# EAGLE schematic 32 pin BB (EAGLE 6.5.0)
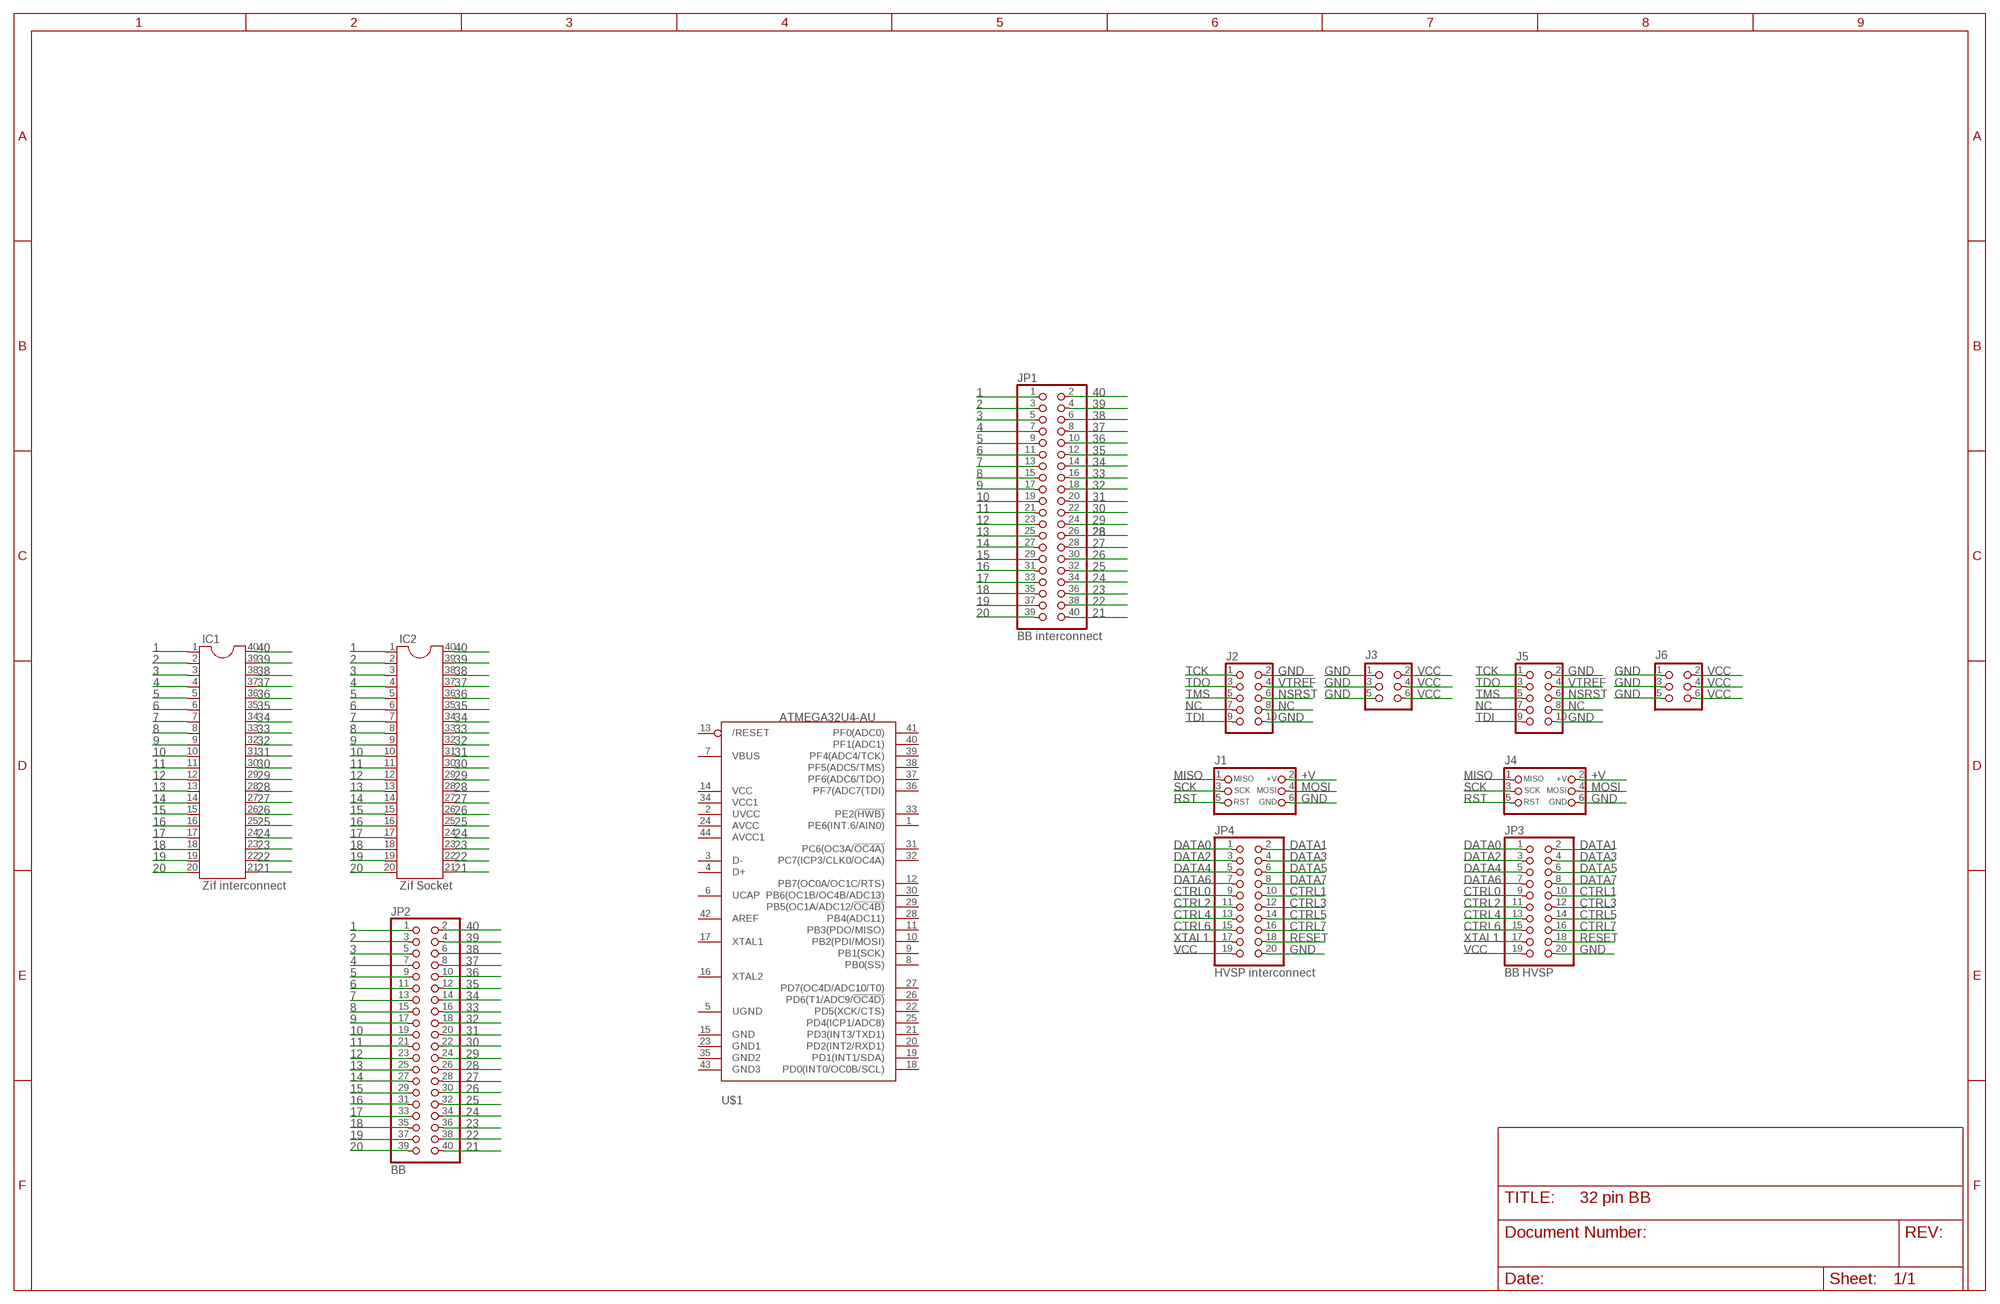
[diagram p0: schematic, sheet 1]

## Parts
IC1  Zif interconnect  DIL40  [DIL40]
IC2  Zif Socket  DIL40  [DIL40]
J1  CON_HEADER_PRG_AVR_ICSP  [HEADER_PRG_2X03]
J2  CON_HEADER_2X05-PTH  [M2X5]
J3  CON_HEADER_2X03-PTH  [M2X3]
J4  CON_HEADER_PRG_AVR_ICSP  [HEADER_PRG_2X03]
J5  CON_HEADER_2X05-PTH  [M2X5]
J6  CON_HEADER_2X03-PTH  [M2X3]
JP1  BB interconnect  PINHD-2X20  [2X20]
JP2  BB  PINHD-2X20  [2X20]
JP3  BB HVSP  PINHD-2X10  [2X10]
JP4  HVSP interconnect  PINHD-2X10  [2X10]
U$1  ATMEGA32U4-AU  [TQFP44]

## Nets
1: IC1.1 IC2.1 JP1.1 JP2.1
2: IC1.2 IC2.2 JP1.3 JP2.3
3: IC1.3 IC2.3 JP1.5 JP2.5
4: IC1.4 IC2.4 JP1.7 JP2.7
5: IC1.5 IC2.5 JP1.9 JP2.9
6: IC1.6 IC2.6 JP1.11 JP2.11
7: IC1.7 IC2.7 JP1.13 JP2.13
8: IC1.8 IC2.8 JP1.15 JP2.15
9: IC1.9 IC2.9 JP1.17 JP2.17
10: IC1.10 IC2.10 JP1.19 JP2.19
11: IC1.11 IC2.11 JP1.21 JP2.21
12: IC1.12 IC2.12 JP1.23 JP2.23
13: IC1.13 IC2.13 JP1.25 JP2.25
14: IC1.14 IC2.14 JP1.27 JP2.27
15: IC1.15 IC2.15 JP1.29 JP2.29
16: IC1.16 IC2.16 JP1.31 JP2.31
17: IC1.17 IC2.17 JP1.33 JP2.33
18: IC1.18 IC2.18 JP1.35 JP2.35
19: IC1.19 IC2.19 JP1.37 JP2.37
20: IC1.20 IC2.20 JP1.39 JP2.39
21: IC1.21 IC2.21 JP1.40 JP2.40
22: IC1.22 IC2.22 JP1.38 JP2.38
23: IC1.23 IC2.23 JP1.36 JP2.36
24: IC1.24 IC2.24 JP1.34 JP2.34
25: IC1.25 IC2.25 JP1.32 JP2.32
26: IC1.26 IC2.26 JP1.30 JP2.30
27: IC1.27 IC2.27 JP1.28 JP2.28
28: IC1.28 IC2.28 JP1.26 JP2.26
29: IC1.29 IC2.29 JP1.24 JP2.24
30: IC1.30 IC2.30 JP1.22 JP2.22
31: IC1.31 IC2.31 JP1.20 JP2.20
32: IC1.32 IC2.32 JP1.18 JP2.18
33: IC1.33 IC2.33 JP1.16 JP2.16
34: IC1.34 IC2.34 JP1.14 JP2.14
35: IC1.35 IC2.35 JP1.12 JP2.12
36: IC1.36 IC2.36 JP1.10 JP2.10
37: IC1.37 IC2.37 JP1.8 JP2.8
38: IC1.38 IC2.38 JP1.6 JP2.6
39: IC1.39 IC2.39 JP1.4 JP2.4
40: IC1.40 IC2.40 JP1.2 JP2.2
+V: J1.2(+V) J4.2(+V)
CTRL0: JP3.9 JP4.9
CTRL1: JP3.10 JP4.10
CTRL2: JP3.11 JP4.11
CTRL3: JP3.12 JP4.12
CTRL4: JP3.13 JP4.13
CTRL5: JP3.14 JP4.14
CTRL6: JP3.15 JP4.15
CTRL7: JP3.16 JP4.16
DATA0: JP3.1 JP4.1
DATA1: JP3.2 JP4.2
DATA2: JP3.3 JP4.3
DATA3: JP3.4 JP4.4
DATA4: JP3.5 JP4.5
DATA5: JP3.6 JP4.6
DATA6: JP3.7 JP4.7
DATA7: JP3.8 JP4.8
GND: J1.6(GND) J2.2 J2.10 J3.1 J3.3 J3.5 J4.6(GND) J5.2 J5.10 J6.1 J6.3 J6.5 JP3.20 JP4.20
MISO: J1.1(MISO) J4.1(MISO)
MOSI: J1.4(MOSI) J4.4(MOSI)
NC: J2.7 J2.8 J5.7 J5.8
NSRST: J2.6 J5.6
RESET: JP3.18 JP4.18
RST: J1.5(RST) J4.5(RST)
SCK: J1.3(SCK) J4.3(SCK)
TCK: J2.1 J5.1
TDI: J2.9 J5.9
TDO: J2.3 J5.3
TMS: J2.5 J5.5
VCC: J3.2 J3.4 J3.6 J6.2 J6.4 J6.6 JP3.19 JP4.19
VTREF: J2.4 J5.4
XTAL1: JP3.17 JP4.17
Unconnected: U$1.1(PE6(INT.6/AIN0)) U$1.2(UVCC) U$1.3(D-) U$1.4(D+) U$1.5(UGND) U$1.6(UCAP) U$1.7(VBUS) U$1.8(PB0(SS)) U$1.9(PB1(SCK)) U$1.10(PB2(PDI/MOSI)) U$1.11(PB3(PDO/MISO)) U$1.12(PB7(OC0A/OC1C/RTS)) U$1.13(/RESET) U$1.14(VCC) U$1.15(GND) U$1.16(XTAL2) U$1.17(XTAL1) U$1.18(PD0(INT0/OC0B/SCL)) U$1.19(PD1(INT1/SDA)) U$1.20(PD2(INT2/RXD1)) U$1.21(PD3(INT3/TXD1)) U$1.22(PD5(XCK/CTS)) U$1.23(GND1) U$1.24(AVCC) U$1.25(PD4(ICP1/ADC8)) U$1.26(PD6(T1/ADC9/!OC4D)) U$1.27(PD7(OC4D/ADC10/T0)) U$1.28(PB4(ADC11)) U$1.29(PB5(OC1A/ADC12/!OC4B)) U$1.30(PB6(OC1B/OC4B/ADC13)) U$1.31(PC6(OC3A/!OC4A)) U$1.32(PC7(ICP3/CLK0/OC4A)) U$1.33(PE2(!HWB)) U$1.34(VCC1) U$1.35(GND2) U$1.36(PF7(ADC7(TDI)) U$1.37(PF6(ADC6/TDO)) U$1.38(PF5(ADC5/TMS)) U$1.39(PF4(ADC4/TCK)) U$1.40(PF1(ADC1)) U$1.41(PF0(ADC0)) U$1.42(AREF) U$1.43(GND3) U$1.44(AVCC1)

## Library data of the parts
IC1 IC2 = ic-package:DIL40: Dual In Line
J1 J4 = dp_devices:CON_HEADER_PRG_AVR_ICSP: 2x3 AVR ICSP programming header
J2 J5 = dp_devices:CON_HEADER_2X05: 2x05 pin header
J3 J6 = dp_devices:CON_HEADER_2X03
JP1 JP2 = pinhead:PINHD-2X20: PIN HEADER
JP3 JP4 = pinhead:PINHD-2X10: PIN HEADER
U$1 = adafruit:ATMEGA32U4: http://www.ladyada.net/library/eagle